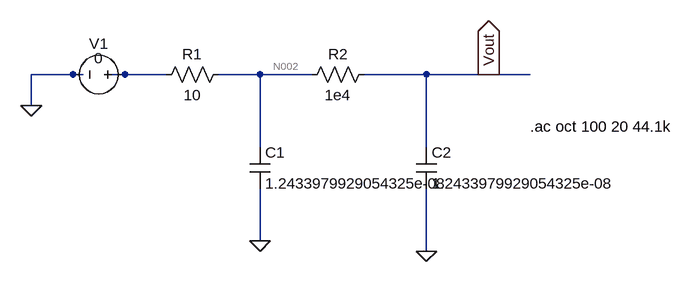
[diagram p0: schematic passive_LPF.asc]
passive_LPF.asc, the LTspice schematic file:
Version 4
SHEET 1 3056 704
WIRE -48 416 -112 416
WIRE -32 416 -48 416
WIRE 32 416 0 416
WIRE 96 416 32 416
WIRE 240 416 176 416
WIRE 320 416 240 416
WIRE 496 416 400 416
WIRE 592 416 496 416
WIRE 656 416 592 416
WIRE -112 464 -112 416
WIRE 240 528 240 416
WIRE 496 528 496 416
WIRE 240 672 240 592
WIRE 496 688 496 592
FLAG 240 672 0
FLAG 496 688 0
FLAG -112 464 0
FLAG 592 416 Vout
IOPIN 592 416 Out
SYMBOL res 192 400 R90
WINDOW 0 0 56 VBottom 2
WINDOW 3 32 56 VTop 2
SYMATTR InstName R1
SYMATTR Value 10
SYMBOL res 416 400 R90
WINDOW 0 0 56 VBottom 2
WINDOW 3 32 56 VTop 2
SYMATTR InstName R2
SYMATTR Value 1e4
SYMBOL cap 224 528 R0
SYMATTR InstName C1
SYMATTR Value 1.2433979929054325e-08
SYMBOL cap 480 528 R0
SYMATTR InstName C2
SYMATTR Value 1.2433979929054325e-08
SYMBOL voltage 48 416 R90
WINDOW 0 -32 56 VBottom 2
WINDOW 3 -10 56 VBottom 2
SYMATTR InstName V1
SYMATTR Value 0
SYMATTR Value2 AC 1
TEXT 656 496 Left 2 !.ac oct 100 20 44.1k

The netlist it stands for:
* passive_LPF.asc
R1 N002 N001 10
R2 Vout N002 1e4
C1 N002 0 1.2433979929054325e-08
C2 Vout 0 1.2433979929054325e-08
V1 N001 0 0 AC 1
.ac oct 100 20 44.1k
.backanno
.end

* Results of the author's LTspice run, read from the files saved beside the schematic
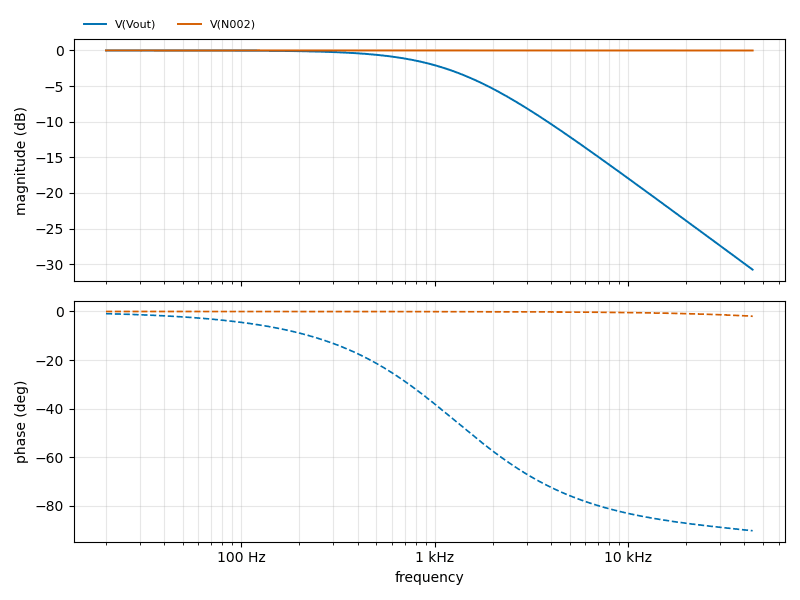
[diagram p1: AC Analysis of passive_LPF.asc, plotted from the saved traces]
* AC Analysis, 1 run:
*   V(Vout): -0.00 dB at 20 Hz, -30.76 dB at 44.1 kHz, peak -0.00 dB at 20 Hz, 3 dB below the peak at 1.279 kHz
*   V(N002): -0.00 dB at 20 Hz, -0.01 dB at 44.1 kHz, peak -0.00 dB at 20 Hz